# Altium schematic sheet HDN_Management.SchDoc
size A4; Organization: Creotech Instruments; Address1: Gen. L. Okulickiego 7/9; Address2: 05-500 Piaseczno; Address3: Poland
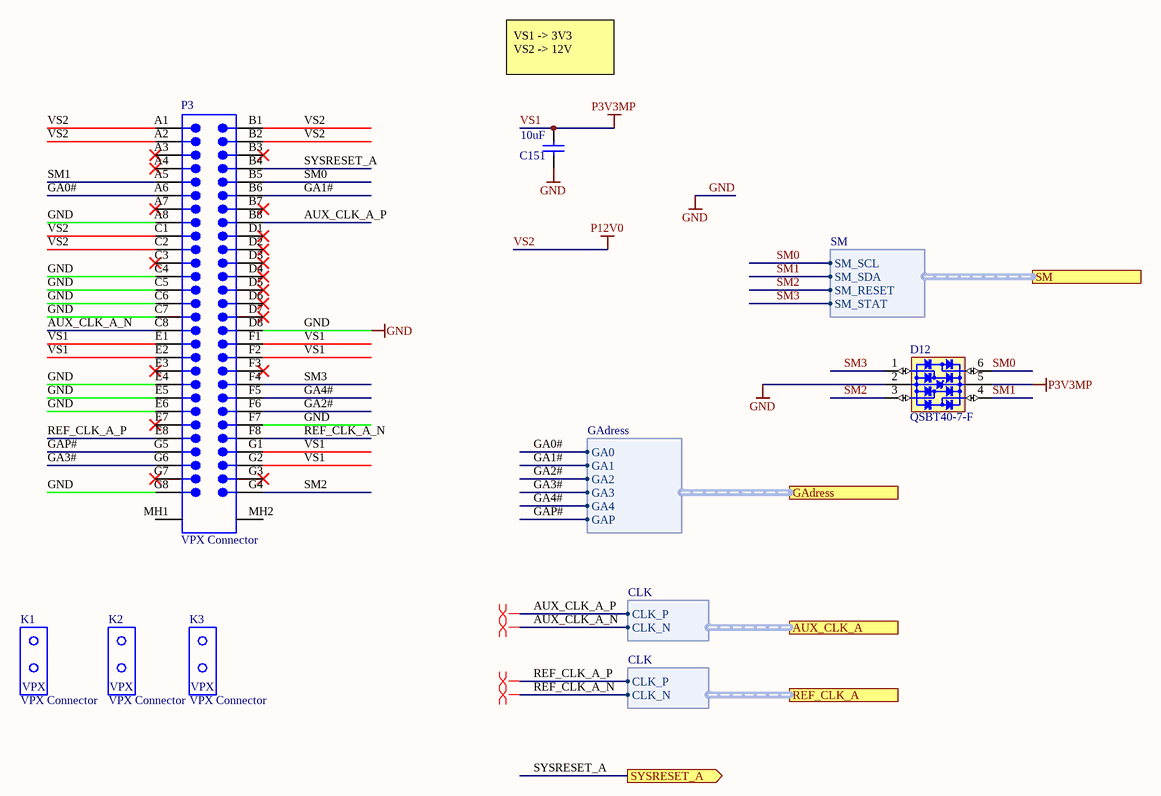
[diagram p0: HDN_Management.SchDoc]

## Parts
C151  10uF  [CAPC2012X135N]
D12  QSBT40-7-F  [SOT65P210X110-6N]
K1  VPX Connector  [BTB5-5-2H2F]
K2  VPX Connector  [BTB5-5-2H2F]
K3  VPX Connector  [BTB5-5-2H2F]
P3  VPX Connector  [BTB1-8-2H56M]

## Ports
AUX_CLK_A (harness CLK), GAdress (harness GAdress), REF_CLK_A (harness CLK), SM (harness SM), SYSRESET_A (out)

## Harnesses
SM: SM_SCL, SM_SDA, SM_RESET, SM_STAT
GAdress: GA0, GA1, GA2, GA3, GA4, GAP
CLK: CLK_P, CLK_N

## Nets
GND: C151.1 D12.2(GND) P3.A8 P3.C4 P3.C5 P3.C6 P3.C7 P3.D8 P3.E4 P3.E5 P3.E6 P3.F7 P3.G8
VS1: C151.2 D12.5(VBUS) P3.E1 P3.E2 P3.F1 P3.F2 P3.G1 P3.G2  [also labelled P3V3MP]
VS2: P3.A1 P3.A2 P3.B1 P3.B2 P3.C1 P3.C2  [also labelled P12V0]
AUX_CLK_A_N: P3.C8 ; port AUX_CLK_A.CLK_N
AUX_CLK_A_P: P3.B8 ; port AUX_CLK_A.CLK_P
GA0#: P3.A6 ; port GAdress.GA0
GA1#: P3.B6 ; port GAdress.GA1
GA2#: P3.F6 ; port GAdress.GA2
GA3#: P3.G6 ; port GAdress.GA3
GA4#: P3.F5 ; port GAdress.GA4
GAP#: P3.G5 ; port GAdress.GAP
REF_CLK_A_N: P3.F8 ; port REF_CLK_A.CLK_N
REF_CLK_A_P: P3.E8 ; port REF_CLK_A.CLK_P
SM0: D12.6(I/O4) P3.B5 ; port SM.SM_SCL
SM1: D12.4(I/O3) P3.A5 ; port SM.SM_SDA
SM2: D12.3(I/O2) P3.G4 ; port SM.SM_RESET
SM3: D12.1(I/O1) P3.F4 ; port SM.SM_STAT
SYSRESET_A: P3.B4 ; port SYSRESET_A

Not connected (* = marked no-connect by the designer): P3 A3* A4* A7* B3* B7* C3* D1* D2* D3* D4* D5* D6* D7* E3* E7* F3* G3* G7* MH1 MH2

## Layout directives
differential pair: AUX_CLK_A_N, AUX_CLK_A_P, REF_CLK_A_N, REF_CLK_A_P

## Notes on the sheet
- VS1 -> 3V3
  VS2 -> 12V
- Title
- Size:
- Date:
- A4
- Number:
- Time:
- Revision:
- Sheet
- of
- File:
- (in symbol CON_VPX_1469492-1) VPX

## Library data of the parts
C151 = CC0805_10UF_16V_10%_X5R: Non-polarised capacitor; Part Description: SMD Multilayer Chip Ceramic Capacitor; Manufacturer: GENERIC; Manufacturer1 Part Number: C0805C106K4PAC; Voltage: 16V; TC: X5R; Tolerance: ±10%; Part Number: CC0805_10UF_16V_10%_X5R; Component Kind: Standard; Component Type: Standard; Pin Count: 2; Value: 10uF; Status: Preferred; Manufacturer Part Number: CC0805_10UF_16V_10%_X5R; Case: 0805; Mounted: Yes; Socket: No; SMD: Yes; Sense: No; Manufacturer1 Example: KEMET; Manufacturer1 ComponentHeight: 1.4mm; HelpURL: \\cern.ch\dfs\Applications\Altium\Datasheets\CC1206_X5R_KEMET.pdf; Author: CERN DEM JLC; CreateDate: 03/12/2007; LatestRevisionDate: 03/12/2007
D12 = D_TVS_QSBT40-7-F: Bonding: No; PressFit: No; Case: *; Component Kind: Standard; Component Type: Standard; ComponentHeigth: *; CreateDate: 2018-01-01; Device: QSBT40-7-F; Footprint: SOT363; HelpURL: *; LatestRevisionDate: 2018-01-01; Manufacturer: *; Manufacturer Part Number: QSBT40-7-F; Mounted: Yes; PackageDescription: *; Part Description: *; Part Number: *; Pin Count: 6; Sense: No; SMD: Yes; Socket: No; Value: *
K1-K3 = CON_VPX_1469492-1: VPX VITA 46 Alignment key, Right Angle, 1Key, Key orientation 0; Manufacturer: TE; Bonding: No; ComponentHeigth: 9.7mm; PressFit: No; Case: *; Component Kind: Standard; Component Type: Standard; CreateDate: 2018-01-01; Device: 1469492-1; Footprint: 1469492-1; HelpURL: *; LatestRevisionDate: 2018-01-01; Manufacturer Part Number: 1469492-1; Mounted: Yes; PackageDescription: *; Part Description: VPX VITA 46 Alignment key, Right Angle, 1Key, Key orientation 0; Part Number: 1469492-1; Pin Count: *; Sense: No; SMD: Yes; Socket: No; Family: VPX Connector
P3 = CON_VPX_1410189-3: Board-to-Board Connector, Right Angle, 7-Row, Pitch 1.8mm, 56-Position; Manufacturer: TE; Bonding: No; ComponentHeigth: 14.7mm; PressFit: No; Case: *; Component Kind: Standard; Component Type: Standard; CreateDate: 2018-01-01; Device: 1410189-3; Footprint: 1410189-3; HelpURL: *; LatestRevisionDate: 2018-01-01; Manufacturer Part Number: 1410189-3; Mounted: Yes; PackageDescription: *; Part Description: Board-to-Board Connector, Right Angle, 7-Row, Pitch 1.8mm, 56-Position; Part Number: *; Pin Count: *; Sense: No; SMD: Yes; Socket: No; Family: VPX Connector